# EAGLE schematic xvz13tf-EU (EAGLE 6.4)
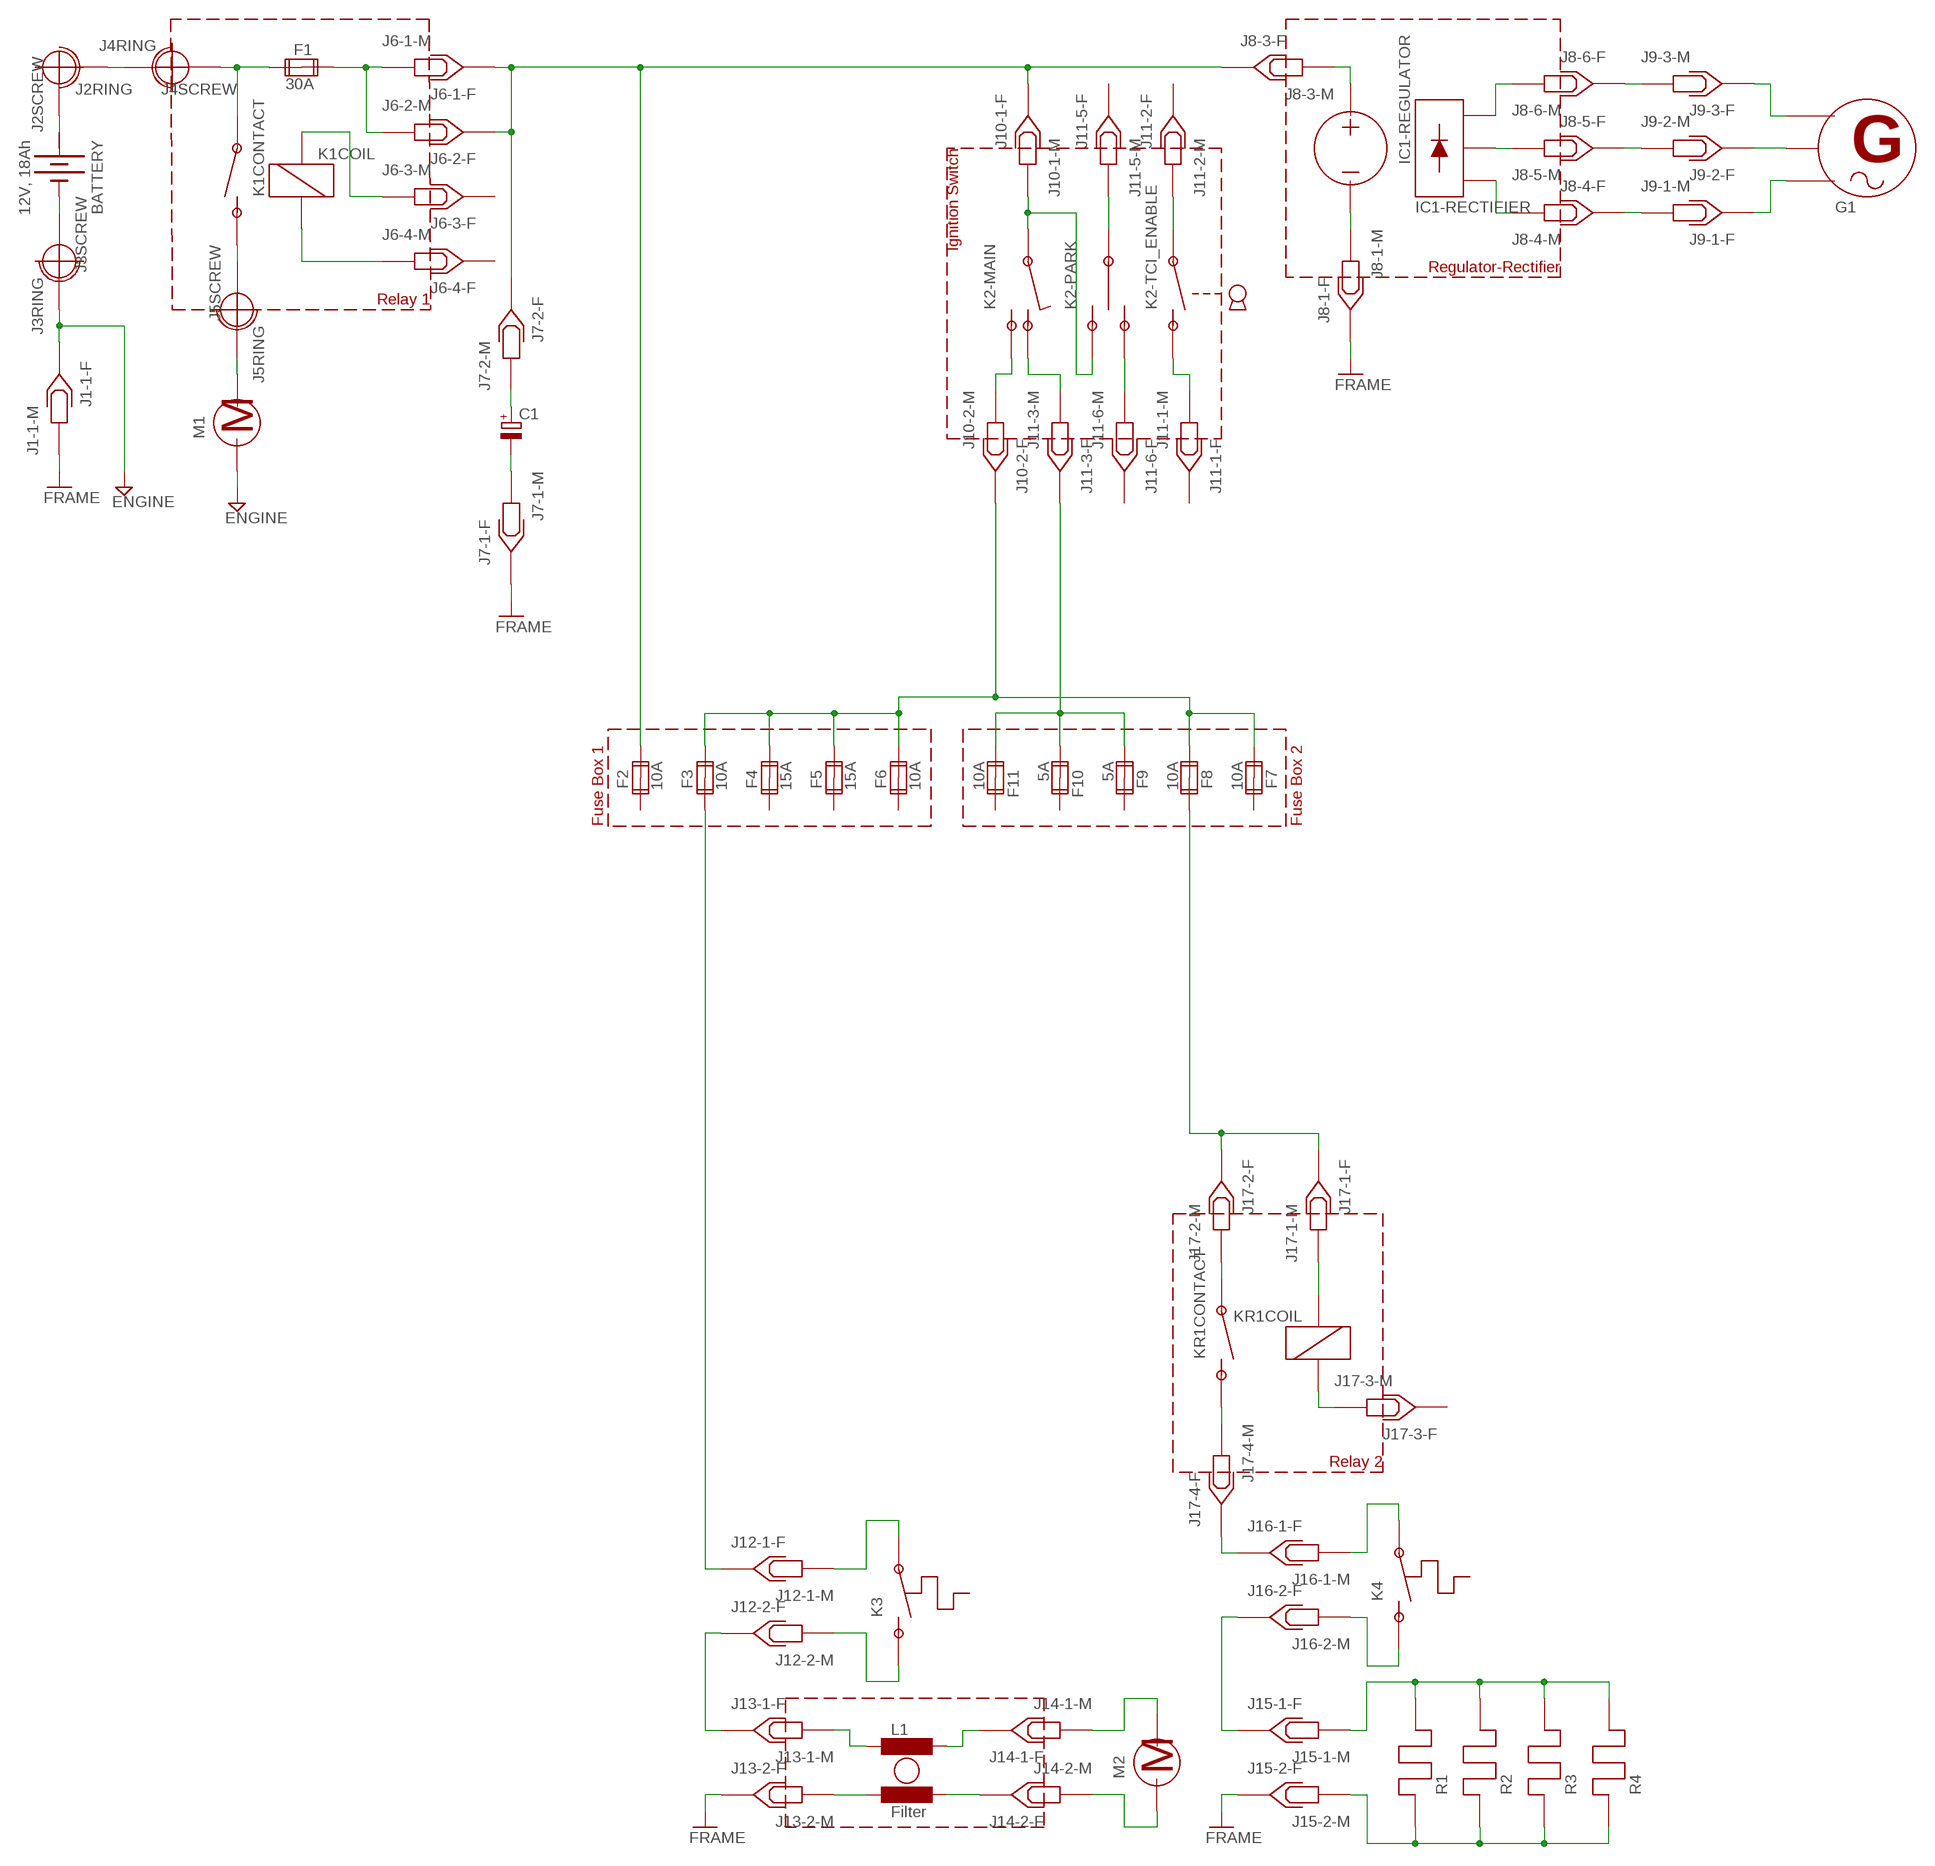
[diagram p0: schematic, sheet 1]

## Parts
BATTERY  12V, 18Ah  BATTERY  [BATTERY]
C1  CPOL-EUE10-35  [EB35D]
F1  30A  FUSE2P  [FUSE1]
F2  10A  FUSE2P  [FUSE1]
F3  10A  FUSE2P  [FUSE1]
F4  15A  FUSE2P  [FUSE1]
F5  15A  FUSE2P  [FUSE1]
F6  10A  FUSE2P  [FUSE1]
F7  10A  FUSE2P  [FUSE1]
F8  10A  FUSE2P  [FUSE1]
F9  5A  FUSE2P  [FUSE1]
F10  5A  FUSE2P  [FUSE1]
F11  10A  FUSE2P  [FUSE1]
L1  Filter  R18  [R18]

## Nets
P$1: BATTERY.+ BATTERY.- C1.+ C1.- F1.1A F1.2A F2.1A F3.1A F3.2A F4.1A F5.1A F6.1A F7.1A F8.1A F8.2A F9.1A F10.1A F11.1A L1.1 L1.2 L1.3 L1.4 ; supply symbol labelled ENGINE, SPADE_1WAY, FRAME, MOTOR, SPADE_4WAY, SPADE_2WAY, SPADE_5WAY, SPADE_3WAY, 3PHASE_ALTERNATOR, SPADE_6WAY
Unconnected: F1.1B F1.2B F2.1B F2.2A F2.2B F3.1B F3.2B F4.1B F4.2A F4.2B F5.1B F5.2A F5.2B F6.1B F6.2A F6.2B F7.1B F7.2A F7.2B F8.1B F8.2B F9.1B F9.2A F9.2B F10.1B F10.2A F10.2B F11.1B F11.2A F11.2B

## Notes on the sheet
- Ignition Switch
- Regulator-Rectifier
- Relay 1
- Fuse Box 1 | Fuse Box 2
- Relay 2

## Power pins joined to a net without a drawn wire
+: BATTERY.+@1(+)

## Library data of the parts
BATTERY = special:BATTERY: BATTERY
C1 = rcl:CPOL-EU: POLARIZED CAPACITOR, European symbol
F1-F11 = special:FUSE2P: FUSE 5 x 20 mm
L1 = inductor-neosid:R: FILTER standard encapsulated line filter; OC_FARNELL: unknown; OC_NEWARK: unknown